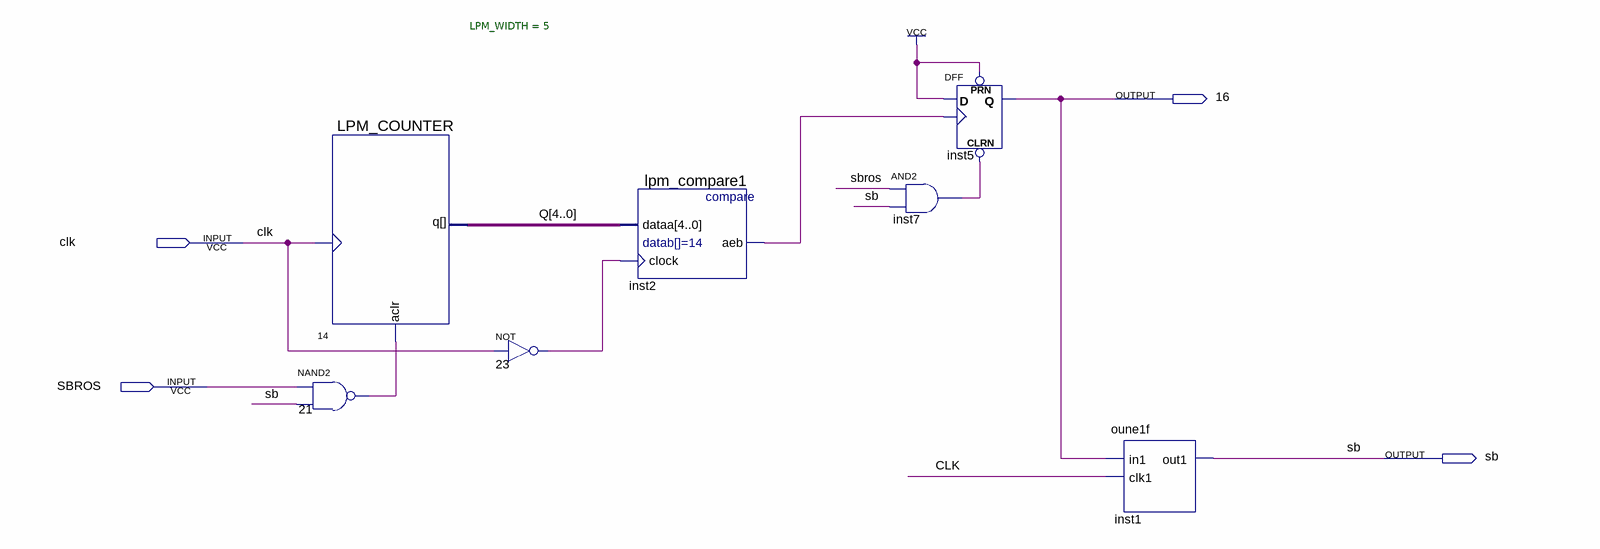
[diagram p0: schematic sheet]
// Quartus schematic count16_8DES.bdf as structural Verilog: 7 symbols, 4 pins
module count16_8DES (
  input  clk,
  input  SBROS,
  output \16 ,
  output sb
);

  wire inst2_aeb, inst7_out, n21_out, n23_out;
  wire [4:0] Q;

  LPM_COUNTER #(.LPM_WIDTH(5)) u_14 (.clock(clk), .aclr(n21_out), .q(Q));
  nand u_21 (n21_out, SBROS, sb);
  not u_23 (n23_out, clk);
  lpm_compare1 inst2 (.dataa(Q), .clock(n23_out), .aeb(inst2_aeb));
  and inst7 (inst7_out, SBROS, sb);
  DFF inst5 (.CLRN(inst7_out), .CLK(inst2_aeb), .D(1'b1), .PRN(1'b1), .Q(\16 ));
  oune1f inst1 (.in1(\16 ), .clk1(clk), .out1(sb));
endmodule
